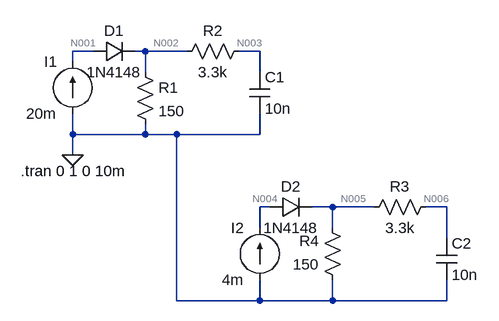
[diagram p0: schematic RC.asc]
RC.asc, the LTspice schematic file:
Version 4
SHEET 1 880 680
WIRE 48 96 16 96
WIRE 128 96 112 96
WIRE 192 96 128 96
WIRE 304 96 272 96
WIRE 16 112 16 96
WIRE 128 128 128 96
WIRE 304 128 304 96
WIRE 16 224 16 192
WIRE 128 224 128 208
WIRE 128 224 16 224
WIRE 176 224 128 224
WIRE 304 224 304 192
WIRE 304 224 176 224
WIRE 16 256 16 224
WIRE 320 336 304 336
WIRE 416 336 384 336
WIRE 480 336 416 336
WIRE 592 336 560 336
WIRE 304 368 304 336
WIRE 416 368 416 336
WIRE 592 384 592 336
WIRE 176 480 176 224
WIRE 304 480 304 448
WIRE 304 480 176 480
WIRE 416 480 416 448
WIRE 416 480 304 480
WIRE 592 480 592 448
WIRE 592 480 416 480
FLAG 16 256 0
SYMBOL res 112 112 R0
SYMATTR InstName R1
SYMATTR Value 150
SYMBOL res 288 80 R90
WINDOW 0 0 56 VBottom 2
WINDOW 3 32 56 VTop 2
SYMATTR InstName R2
SYMATTR Value 3.3k
SYMBOL cap 288 128 R0
SYMATTR InstName C1
SYMATTR Value 10n
SYMBOL current 16 192 R180
WINDOW 0 24 80 Left 2
WINDOW 3 24 0 Left 2
WINDOW 123 0 0 Left 0
WINDOW 39 0 0 Left 0
SYMATTR InstName I1
SYMATTR Value 20m
SYMBOL res 576 320 R90
WINDOW 0 0 56 VBottom 2
WINDOW 3 32 56 VTop 2
SYMATTR InstName R3
SYMATTR Value 3.3k
SYMBOL res 432 464 R180
WINDOW 0 36 76 Left 2
WINDOW 3 36 40 Left 2
SYMATTR InstName R4
SYMATTR Value 150
SYMBOL cap 576 384 R0
SYMATTR InstName C2
SYMATTR Value 10n
SYMBOL current 304 448 R180
WINDOW 0 24 80 Left 2
WINDOW 3 24 0 Left 2
WINDOW 123 0 0 Left 0
WINDOW 39 0 0 Left 0
SYMATTR InstName I2
SYMATTR Value 4m
SYMBOL diode 48 112 R270
WINDOW 0 32 32 VTop 2
WINDOW 3 0 32 VBottom 2
SYMATTR InstName D1
SYMATTR Value 1N4148
SYMBOL diode 320 352 R270
WINDOW 0 32 32 VTop 2
WINDOW 3 0 32 VBottom 2
SYMATTR InstName D2
SYMATTR Value 1N4148
TEXT -64 280 Left 2 !.tran 0 1 0 10m

The netlist it stands for:
* RC.asc
R1 N002 0 150
R2 N003 N002 3.3k
C1 N003 0 10n
I1 0 N001 20m
R3 N006 N005 3.3k
R4 0 N005 150
C2 N006 0 10n
I2 0 N004 4m
D1 N001 N002 1N4148
D2 N004 N005 1N4148
.model D D
.lib standard.dio
.tran 0 1 0 10m
.backanno
.end

* Results of the author's LTspice run, read from the files saved beside the schematic
* Operating Point, zero values left out:
*   V(n002) = 3 V
*   V(n003) = 3 V
*   V(n001) = 3.731 V
*   V(n006) = 600 mV
*   V(n005) = 600 mV
*   V(n004) = 1.249 V
*   I(D2) = 4 mA
*   I(D1) = 20 mA
*   I(I2) = 4 mA
*   I(I1) = 20 mA
*   I(R4) = -4 mA
*   I(R1) = 20 mA